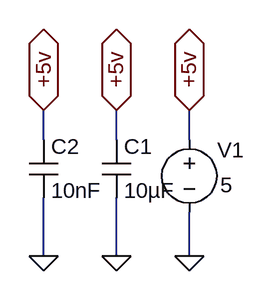
[diagram p0: schematic sources.asc]
sources.asc, the LTspice schematic file:
Version 4
SHEET 1 880 680
WIRE 112 144 112 112
WIRE 192 144 192 112
WIRE 272 144 272 112
WIRE 112 272 112 208
WIRE 192 272 192 208
WIRE 272 272 272 224
FLAG 192 272 0
FLAG 112 272 0
FLAG 272 272 0
FLAG 112 112 +5v
IOPIN 112 112 BiDir
FLAG 192 112 +5v
IOPIN 192 112 BiDir
FLAG 272 112 +5v
IOPIN 272 112 BiDir
SYMBOL voltage 272 128 R0
WINDOW 0 31 28 Left 2
WINDOW 3 34 66 Left 2
WINDOW 123 0 0 Left 0
WINDOW 39 0 0 Left 0
SYMATTR InstName V1
SYMATTR Value 5
SYMBOL cap 176 144 R0
SYMATTR InstName C1
SYMATTR Value 10µF
SYMBOL cap 96 144 R0
SYMATTR InstName C2
SYMATTR Value 10nF

The netlist it stands for:
* sources.asc
V1 +5v 0 5
C1 +5v 0 10µF
C2 +5v 0 10nF
.backanno
.end